# EAGLE design DualMonoPSU4 (EAGLE 9.6.2)
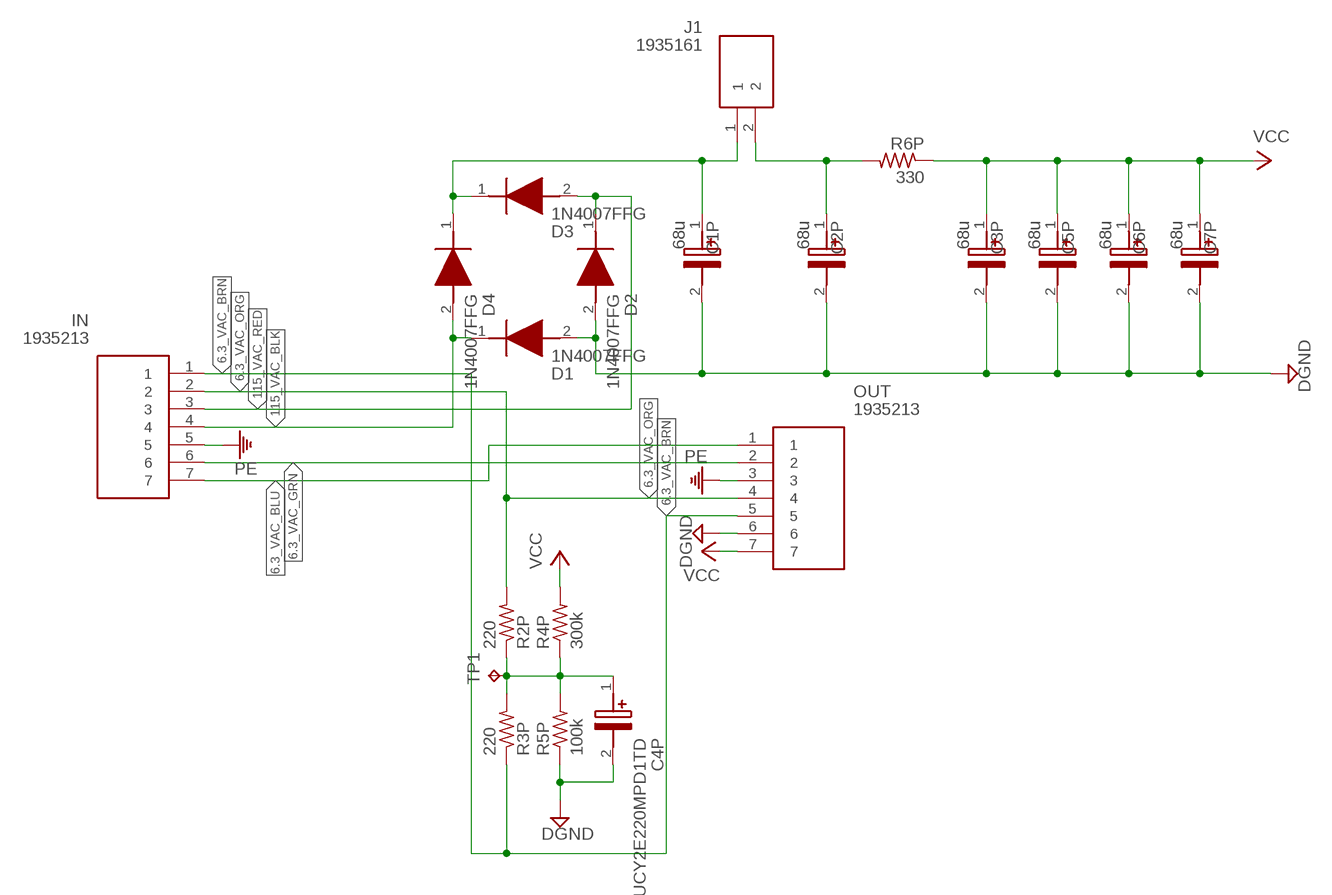
[diagram p0: schematic, sheet 1]

## Parts
C1P  68u  500HXW68MEFR14.5X45  [CAPPRD750W80D1475H4700]
C2P  68u  500HXW68MEFR14.5X45  [CAPPRD750W80D1475H4700]
C3P  68u  500HXW68MEFR14.5X45  [CAPPRD750W80D1475H4700]
C4P  UCY2E220MPD1TD  [CAPPRD500W60D1025H1750]
C5P  68u  500HXW68MEFR14.5X45  [CAPPRD750W80D1475H4700]
C6P  68u  500HXW68MEFR14.5X45  [CAPPRD750W80D1475H4700]
C7P  68u  500HXW68MEFR14.5X45  [CAPPRD750W80D1475H4700]
D1  1N4007FFG  [DIOAD1405W86L465D235]
D2  1N4007FFG  [DIOAD1405W86L465D235]
D3  1N4007FFG  [DIOAD1405W86L465D235]
D4  1N4007FFG  [DIOAD1405W86L465D235]
IN  1935213  [1935213]
J1  1935161  [1935161]
OUT  1935213  [1935213]
R2P  220  R-US_0411/15  [0411/15]
R3P  220  R-US_0411/15  [0411/15]
R4P  300k  R-US_0411/15  [0411/15]
R5P  100k  R-US_0411/15  [0411/15]
R6P  330  R-US_0411/15  [0411/15]
TP1  TPB2,54  [B2,54]

## Nets
6.3_VAC_BLU: IN.7 OUT.1
6.3_VAC_BRN: IN.1 OUT.5 R3P.1
6.3_VAC_GRN: IN.6 OUT.2
6.3_VAC_ORG: IN.2 OUT.4 R2P.2
115_VAC_BLK: D1.1(K) D4.2(A) IN.4
115_VAC_RED: D2.1(K) D3.2(A) IN.3
DGND: C1P.2(-) C2P.2(-) C3P.2(-) C4P.2(-) C5P.2(-) C6P.2(-) C7P.2(-) D1.2(A) D2.2(A) OUT.6 R5P.1
N$3: C1P.1(+) D3.1(K) D4.1(K) J1.1
N$5: C2P.1(+) J1.2 R6P.2
N$6: C4P.1(+) R2P.1 R3P.2 R4P.1 R5P.2 TP1.TP
PE: IN.5 OUT.3
VCC: C3P.1(+) C5P.1(+) C6P.1(+) C7P.1(+) OUT.7 R4P.2 R6P.1

## Library data of the parts
C1P C2P C3P C5P C6P C7P = 500HXW68MEFR14.5X45:500HXW68MEFR14.5X45: Aluminum Electrolytic Capacitors - Radial Leaded GENERAL PURPOSE ELECTROLYTIC CAPACITORS Source: Datasheet <https://www.mouser.com/datasheet/2/977/e_HXW-1600623.pdf>; DESCRIPTION: Aluminum Electrolytic Capacitors - Radial Leaded GENERAL PURPOSE ELECTROLYTIC CAPACITORS; HEIGHT: 47mm; MANUFACTURER_NAME: Rubycon; MANUFACTURER_PART_NUMBER: 500HXW68MEFR14.5X45
C4P = UCY2E220MPD1TD:UCY2E220MPD1TD: Aluminum Electrolytic Capacitors - Radial Leaded 22uF 250V 20% AEC-Q200 Source: Datasheet <https://www.mouser.in/datasheet/2/293/e_ucy-3082387.pdf>; DESCRIPTION: Aluminum Electrolytic Capacitors - Radial Leaded 22uF 250V 20% AEC-Q200; HEIGHT: 17.5mm; MANUFACTURER_NAME: Nichicon; MANUFACTURER_PART_NUMBER: UCY2E220MPD1TD; MOUSER_PART_NUMBER: 647-UCY2E220MPD1TD; MOUSER_PRICE-STOCK: https://www.mouser.co.uk/ProductDetail/Nichicon/UCY2E220MPD1TD?qs=JgOBn5pVFooNXIGMeLbPFg%3D%3D
D1-D4 = 1N4007FFG:1N4007FFG: Rectifiers 1000V 1A Standard Source: Datasheet <http://www.onsemi.com/pub_link/Collateral/1N4001-D.PDF>; DESCRIPTION: Rectifiers 1000V 1A Standard; HEIGHT: mm; MANUFACTURER_NAME: onsemi; MANUFACTURER_PART_NUMBER: 1N4007FFG; MOUSER_PART_NUMBER: 863-1N4007FFG; MOUSER_PRICE-STOCK: https://www.mouser.co.uk/ProductDetail/onsemi/1N4007FFG?qs=y2kkmE52mdPFE87Rxbyfgw%3D%3D
IN OUT = 1935213:1935213: Fixed Terminal Blocks PT 1.5/7-5.0-H Source: Datasheet <https://datasheet.datasheetarchive.com/originals/distributors/SFDatasheet-2/sf-00057464.pdf>; DESCRIPTION: Fixed Terminal Blocks PT 1.5/7-5.0-H; HEIGHT: 11.55mm; MANUFACTURER_NAME: Phoenix Contact; MANUFACTURER_PART_NUMBER: 1935213; MOUSER_PART_NUMBER: 651-1935213; MOUSER_PRICE-STOCK: https://www.mouser.co.uk/ProductDetail/Phoenix-Contact/1935213?qs=wd%252Bw3mUqFrnK4kINj%2Fk1Qg%3D%3D
J1 = 1935161:1935161: Phoenix Contact COMBICON PT PCB Terminal Block, 2 Way/Pole, Screw Terminals, 26 14 AWG Through Hole, Nylon Source: Datasheet <https://datasheet.datasheetarchive.com/originals/distributors/SFDatasheet-2/sf-00057459.pdf>; DESCRIPTION: Phoenix Contact COMBICON PT PCB Terminal Block, 2 Way/Pole, Screw Terminals, 26 14 AWG Through Hole, Nylon; HEIGHT: 11.55mm; MANUFACTURER_NAME: Phoenix Contact; MANUFACTURER_PART_NUMBER: 1935161; MOUSER_PART_NUMBER: 651-1935161; MOUSER_PRICE-STOCK: https://www.mouser.co.uk/ProductDetail/Phoenix-Contact/1935161?qs=W3wJikR1%252BS6eKzfFl8Rbew%3D%3D
R2P R3P R4P R5P R6P = rcl:R-US_: RESISTOR, American symbol; SPICEPREFIX: R
TP1 = testpad:TP: Test pad

## Net classes
3 Power: width 1.27 mm, drill 1.27 mm, clearance 0.254 mm

## Board
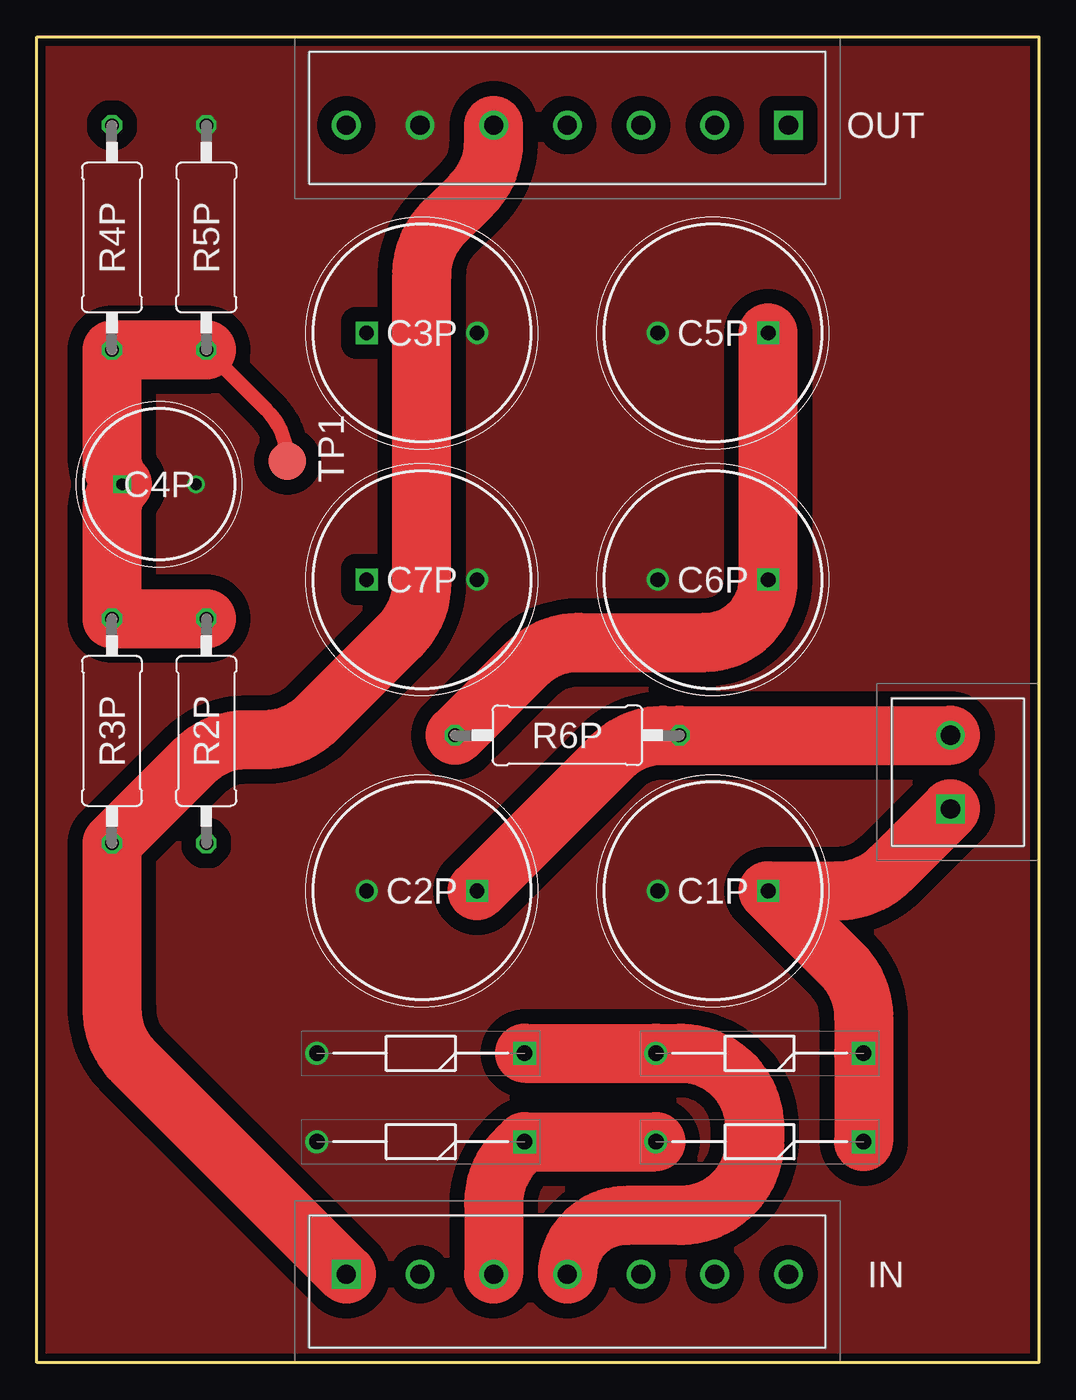
[diagram p1: board, top side]
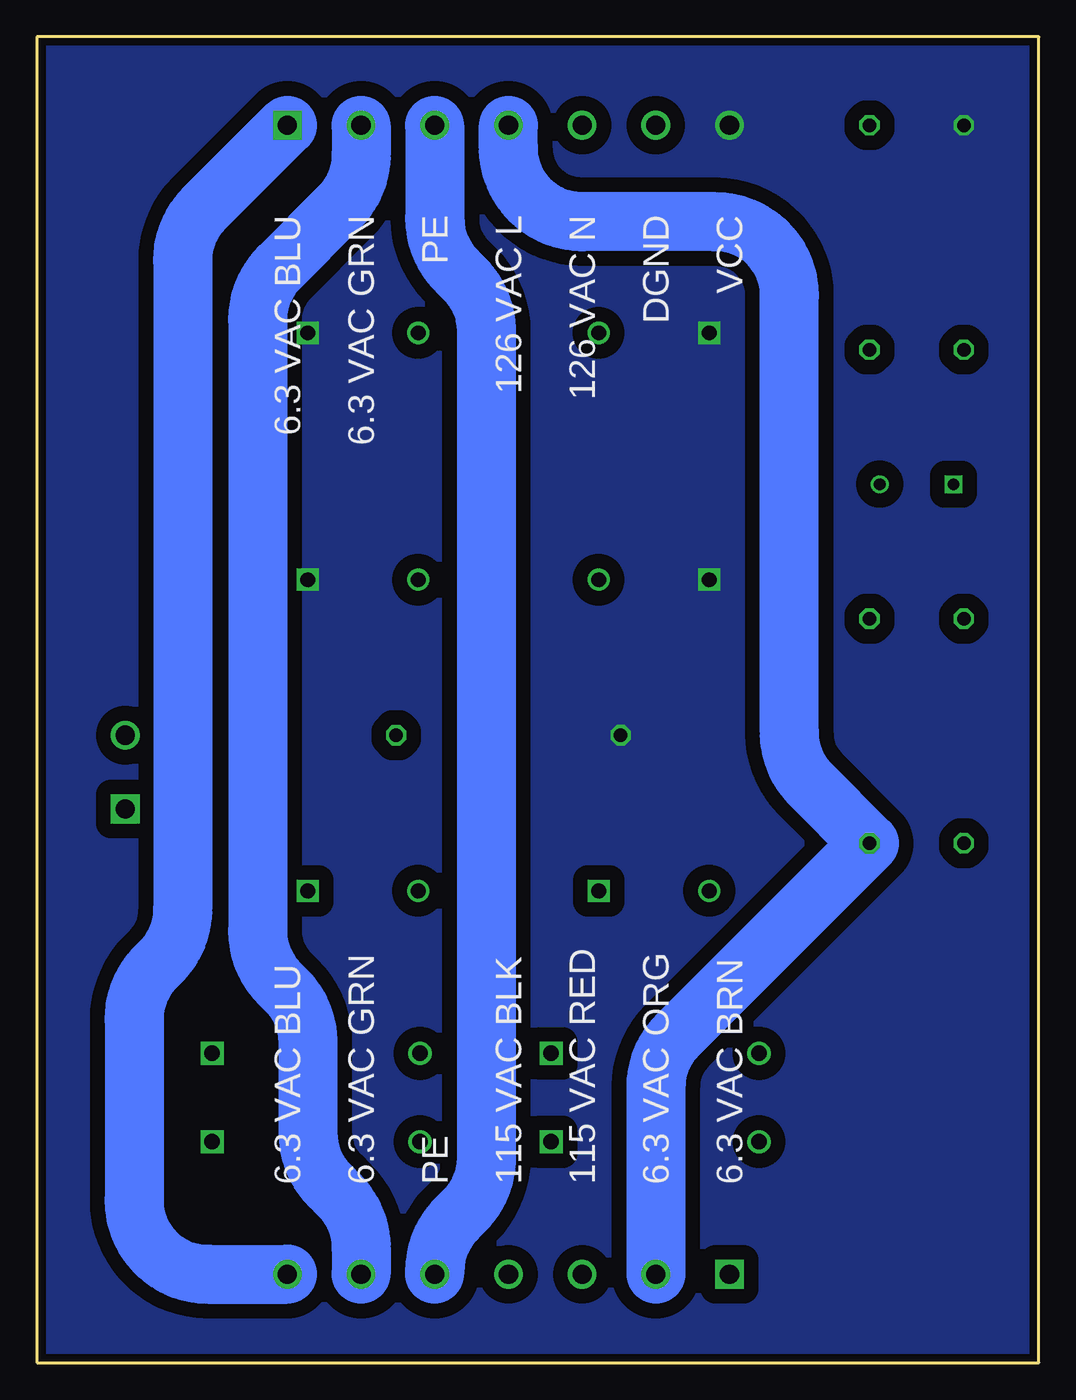
[diagram p2: board, bottom side, seen from below]

Size 68 x 90 mm. Coordinates in mm from the lower left corner, seen from the top.
Outline: 0,0 0,90 68,90 68,0 0,0
Copper layers (1*16): Top 0.035mm / dielectric 1.6mm / Bottom 0.035mm
Design rules "Elecrow_2-layer_PCB_eagle_rule *": minimum track width 1mm, minimum drill 12mil, track to track 1mm, track to pad 6mil, pad to pad 6mil, via to via 8mil, smd to smd 0mil, copper to edge 20mil, drill to drill 10mil, minimum pad ring 6mil, minimum via ring 6mil, stop-mask expansion 0mil, vias tented up to drill 100mil, thermal gap 10mil

### Footprints (pad centres in the part's own frame; a part is rotated, then mirrored left to right if it is on the bottom)
CAPPRD750W80D1475H4700 = drill 1 pad 1.5 square: 1 0,0 | drill 1 pad 1.5: 2 7.5,0
CAPPRD500W60D1025H1750 = drill 0.8 pad 1.2 square: 1 0,0 | drill 0.8 pad 1.2: 2 5,0
DIOAD1405W86L465D235 = drill 1.05 pad 1.575 square: 1 0,0 | drill 1.05 pad 1.575: 2 14.1,0
1935213 = drill 1.3 pad 1.95 square: 1 0,0 | drill 1.3 pad 1.95: 2 5,0; 3 10,0; 4 15,0; 5 20,0; 6 25,0; 7 30,0
1935161 = drill 1.3 pad 1.95 square: 1 0,0 | drill 1.3 pad 1.95: 2 5,0
0411/15 = drill 0.914 octagon: 1 -7.62,0; 2 7.62,0
B2,54 = smd 2.54 x 2.54: TP 0,0

### Placement (x,y rotation side)
C1P  49.62,32.03 180 top
C2P  29.88,32.03 180 top
C3P  22.38,69.9 0 top
C4P  5.8,59.63 0 top
C5P  49.62,69.9 180 top
C6P  49.62,53.15 180 top
C7P  22.38,53.15 0 top
D1  33.1,21 180 top
D2  33.1,15 180 top
D3  56.1,15 180 top
D4  56.1,21 180 top
IN  21,6 0 top
J1  62,37.59 90 top
OUT  51,84 180 top
R2P  11.5,42.88 270 top
R3P  5.1,42.88 90 top
R4P  5.1,76.38 90 top
R5P  11.5,76.38 270 top
R6P  36,42.59 0 top
TP1  17,61.2 0 top

### Tracks (layer width: path | path; a pad name or v marks a point on that pad's centre or on a via)
6.3_VAC_BLU
  Bottom 4: OUT.1 56.64,78.36 arc-45 58.11,74.82 58.11,30.76 arc45 59.57,27.23 59.94,26.86 arc-45 61.4,23.33 61.4,11 arc-90 56.4,6 IN.7
6.3_VAC_BRN
  Top 4: OUT.5 31,82.87 arc-45 29.54,79.34 27.59,77.39 arc45 26.12,73.85 26.12,52.93 arc-45 24.66,49.39 19.03,43.76 arc-45 15.5,42.3 14.21,42.3 arc45 10.68,40.84 R3P.1 5.1,23.97 arc45 6.56,20.44 IN.1
6.3_VAC_GRN
  Bottom 4: IN.6 46,7.83 arc-45 47.46,11.36 48.14,12.04 arc45 49.6,15.57 49.6,21.73 arc-45 51.06,25.26 51.55,25.75 arc45 53.02,29.29 53.02,70.81 arc45 51.55,74.35 47.46,78.44 arc-45 46,81.97 OUT.2
6.3_VAC_ORG
  Bottom 4: OUT.4 36,82.45 arc-90 31,77.45 21.94,77.45 arc90 16.94,72.45 16.94,42.77 arc-45 15.47,39.23 R2P.2 24.54,22.22 arc-45 26,18.69 IN.2
115_VAC_BLK
  Top 4: D1.1 D4.2 43.7,21 arc-90 48.7,16 48.7,15 arc-90 43.7,10 40,10 arc90 IN.4
115_VAC_RED
  Top 4: D3.2 D2.1 32.46,14.36 arc45 31,10.83 IN.3
DGND
  pour Top (rank 6, no thermals): 68,0 0,0 0,90 68,90
N$3
  Top 4: D3.1 D4.1 56.1,23.48 arc45 54.64,27.02 C1P.1 54.37,32.03 arc45 57.9,33.49 J1.1
N$5
  Top 4: J1.2 R6P.2 42.51,42.59 arc45 38.97,41.13 C2P.1
N$6
  Top 1: R5P.2 15.54,64.72 arc-45 TP1.TP
  Top 4: R5P.2 R4P.1 5.1,61.32 arc45 C4P.1 arc45 5.1,57.94 R3P.2 R2P.1
PE
  Bottom 4: OUT.3 41,77.67 arc-45 39.54,74.14 38.96,73.56 arc45 37.5,70.03 37.5,13.87 arc45 38.96,10.34 39.54,9.76 arc-45 41,6.23 IN.5
VCC
  Top 4: C5P.1 C6P.1 arc-90 45.38,48.9 36.76,48.9 arc45 33.23,47.44 R6P.1
  pour Bottom (rank 6, no thermals): 68,0 0,0 0,90 68,90

### Text on the board
bNames: VCC | DGND | 126 VAC N | 126 VAC L | PE | 6.3 VAC GRN | 6.3 VAC BLU | 6.3 VAC BRN | 6.3 VAC ORG | 115 VAC RED | 115 VAC BLK | PE | 6.3 VAC GRN | 6.3 VAC BLU